# Altium project Board2.PrjPCB
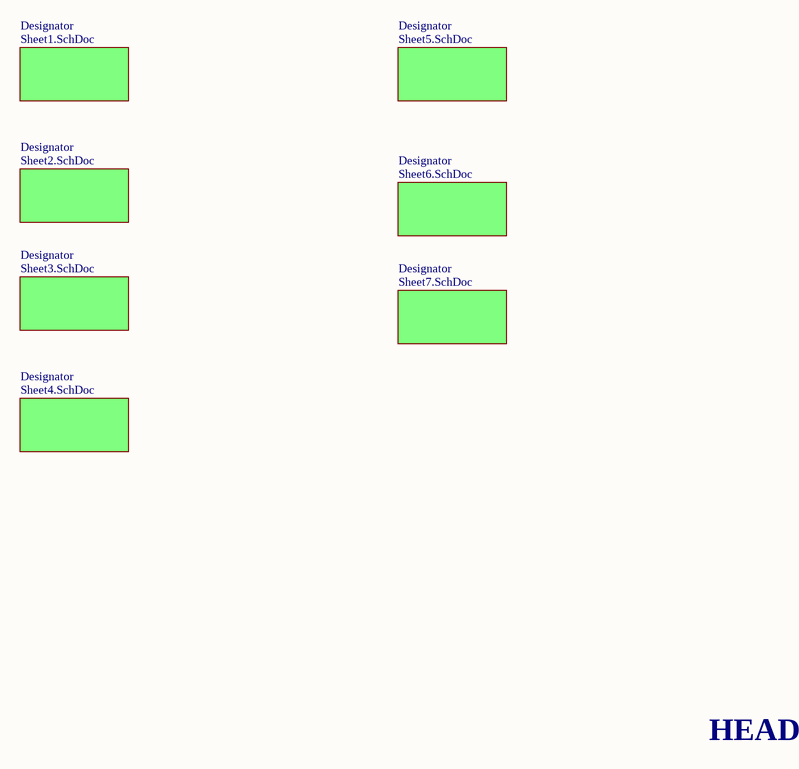
[diagram p0: HEAD.SchDoc]
8 sheets, 176 parts. Net scope: global (net labels, ports and power ports of the same name join across sheets).
Board file: Board2.PcbDoc
Sheets:
  HEAD.SchDoc
    Designator = Sheet1.SchDoc
    Designator = Sheet2.SchDoc
    Designator = Sheet3.SchDoc
    Designator = Sheet4.SchDoc
    Designator = Sheet5.SchDoc
    Designator = Sheet6.SchDoc
    Designator = Sheet7.SchDoc

## Sheet HEAD.SchDoc
size A4

### Sub-sheets
Designator = Sheet1.SchDoc: no entries
Designator = Sheet2.SchDoc: no entries
Designator = Sheet3.SchDoc: no entries
Designator = Sheet4.SchDoc: no entries
Designator = Sheet5.SchDoc: no entries
Designator = Sheet6.SchDoc: no entries
Designator = Sheet7.SchDoc: no entries

### Notes on the sheet
- HEAD

## Sheet Sheet1.SchDoc
size A4
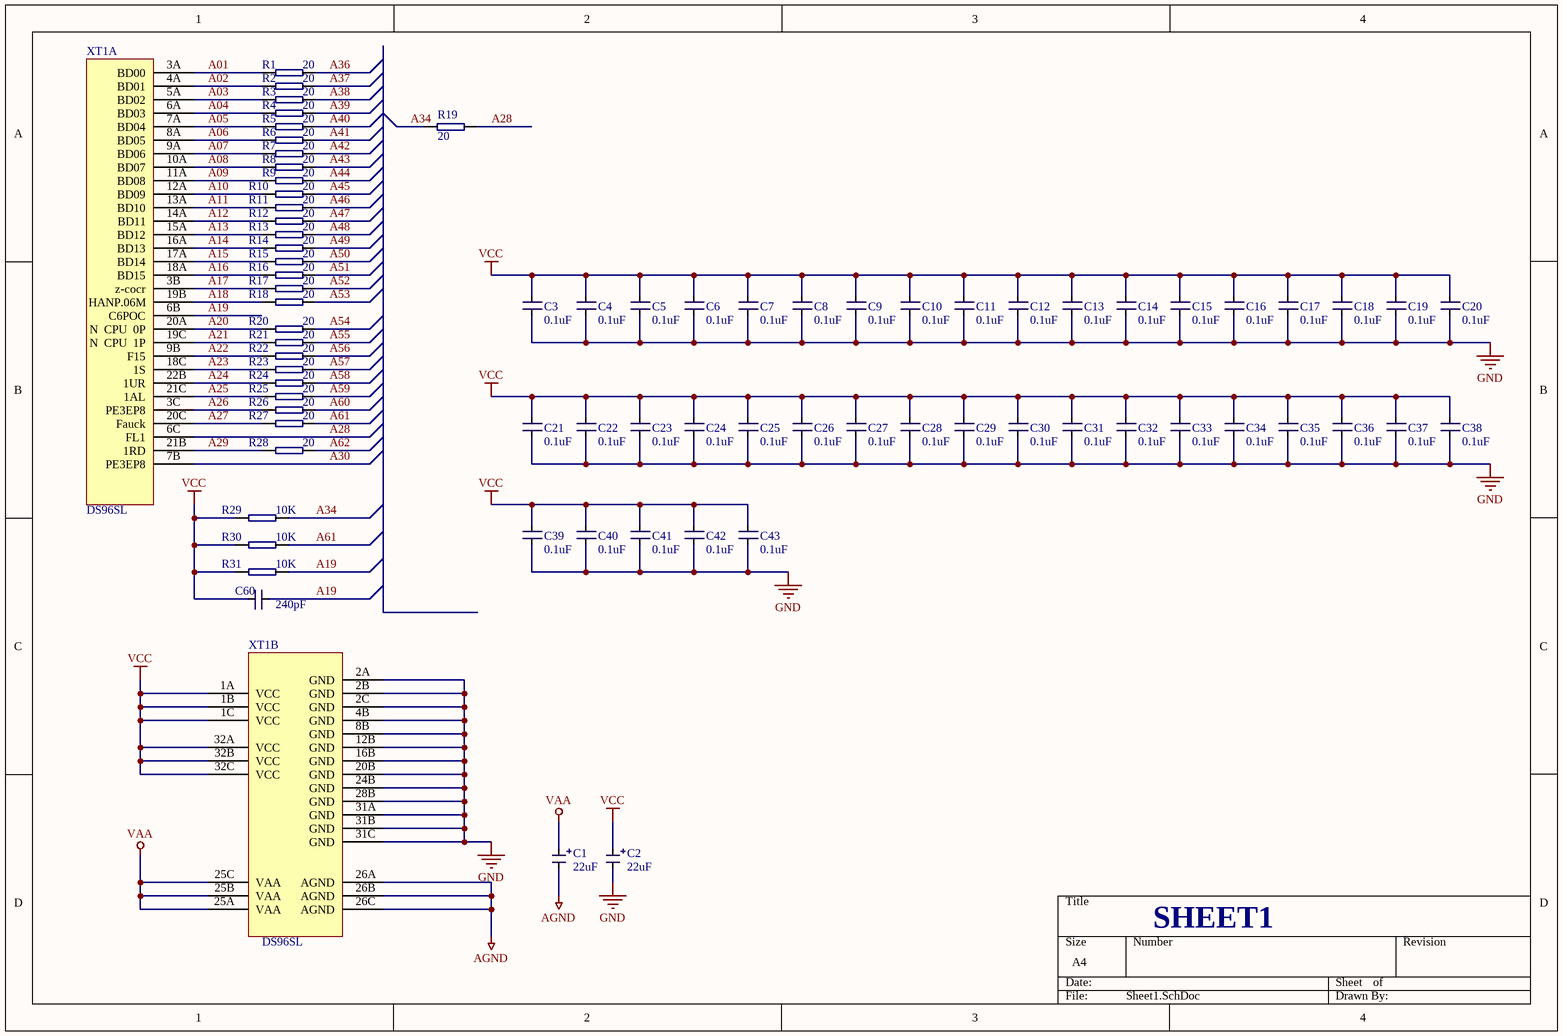
[diagram p1: Sheet1.SchDoc]

### Parts
C1  value 22uF  [B(1812)]  (hidden comment: Cap2)
C2  value 22uF  [B(1812)]  (hidden comment: Cap2)
C3  value 0.1uF  [0805]  (hidden comment: Cap)
C4  value 0.1uF  [0805]  (hidden comment: Cap)
C5  value 0.1uF  [0805]  (hidden comment: Cap)
C6  value 0.1uF  [0805]  (hidden comment: Cap)
C7  value 0.1uF  [0805]  (hidden comment: Cap)
C8  value 0.1uF  [0805]  (hidden comment: Cap)
C9  value 0.1uF  [0805]  (hidden comment: Cap)
C10  value 0.1uF  [0805]  (hidden comment: Cap)
C11  value 0.1uF  [0805]  (hidden comment: Cap)
C12  value 0.1uF  [0805]  (hidden comment: Cap)
C13  value 0.1uF  [0805]  (hidden comment: Cap)
C14  value 0.1uF  [0805]  (hidden comment: Cap)
C15  value 0.1uF  [0805]  (hidden comment: Cap)
C16  value 0.1uF  [0805]  (hidden comment: Cap)
C17  value 0.1uF  [0805]  (hidden comment: Cap)
C18  value 0.1uF  [0805]  (hidden comment: Cap)
C19  value 0.1uF  [0805]  (hidden comment: Cap)
C20  value 0.1uF  [0805]  (hidden comment: Cap)
C21  value 0.1uF  [0805]  (hidden comment: Cap)
C22  value 0.1uF  [0805]  (hidden comment: Cap)
C23  value 0.1uF  [0805]  (hidden comment: Cap)
C24  value 0.1uF  [0805]  (hidden comment: Cap)
C25  value 0.1uF  [0805]  (hidden comment: Cap)
C26  value 0.1uF  [0805]  (hidden comment: Cap)
C27  value 0.1uF  [0805]  (hidden comment: Cap)
C28  value 0.1uF  [0805]  (hidden comment: Cap)
C29  value 0.1uF  [0805]  (hidden comment: Cap)
C30  value 0.1uF  [0805]  (hidden comment: Cap)
C31  value 0.1uF  [0805]  (hidden comment: Cap)
C32  value 0.1uF  [0805]  (hidden comment: Cap)
C33  value 0.1uF  [0805]  (hidden comment: Cap)
C34  value 0.1uF  [0805]  (hidden comment: Cap)
C35  value 0.1uF  [0805]  (hidden comment: Cap)
C36  value 0.1uF  [0805]  (hidden comment: Cap)
C37  value 0.1uF  [0805]  (hidden comment: Cap)
C38  value 0.1uF  [0805]  (hidden comment: Cap)
C39  value 0.1uF  [0805]  (hidden comment: Cap)
C40  value 0.1uF  [0805]  (hidden comment: Cap)
C41  value 0.1uF  [0805]  (hidden comment: Cap)
C42  value 0.1uF  [0805]  (hidden comment: Cap)
C43  value 0.1uF  [0805]  (hidden comment: Cap)
C60  value 240pF  [0805]  (hidden comment: Cap)
R1  value 20  [0805]  (hidden comment: R)
R2  value 20  [0805]  (hidden comment: R)
R3  value 20  [0805]  (hidden comment: R)
R4  value 20  [0805]  (hidden comment: R)
R5  value 20  [0805]  (hidden comment: R)
R6  value 20  [0805]  (hidden comment: R)
R7  value 20  [0805]  (hidden comment: R)
R8  value 20  [0805]  (hidden comment: R)
R9  value 20  [0805]  (hidden comment: R)
R10  value 20  [0805]  (hidden comment: R)
R11  value 20  [0805]  (hidden comment: R)
R12  value 20  [0805]  (hidden comment: R)
R13  value 20  [0805]  (hidden comment: R)
R14  value 20  [0805]  (hidden comment: R)
R15  value 20  [0805]  (hidden comment: R)
R16  value 20  [0805]  (hidden comment: R)
R17  value 20  [0805]  (hidden comment: R)
R18  value 20  [0805]  (hidden comment: R)
R19  value 20  [0805]  (hidden comment: R)
R20  value 20  [0805]  (hidden comment: R)
R21  value 20  [0805]  (hidden comment: R)
R22  value 20  [0805]  (hidden comment: R)
R23  value 20  [0805]  (hidden comment: R)
R24  value 20  [0805]  (hidden comment: R)
R25  value 20  [0805]  (hidden comment: R)
R26  value 20  [0805]  (hidden comment: R)
R27  value 20  [0805]  (hidden comment: R)
R28  value 20  [0805]  (hidden comment: R)
R29  value 10K  [0805]  (hidden comment: R)
R30  value 10K  [0805]  (hidden comment: R)
R31  value 10K  [0805]  (hidden comment: R)
XT1  DS96SL  [DS96]  (parts A,B of 3)

### Nets
AGND: C1.2 XT1.26A(AGND) XT1.26B(AGND) XT1.26C(AGND)  [project net B110]
GND: C2.2 C3.1 C4.1 C5.1 C6.1 C7.1 C8.1 C9.1 C10.1 C11.1 C12.1 C13.1 C14.1 C15.1 C16.1 C17.1 C18.1 C19.1 C20.1 C21.1 C22.1 C23.1 C24.1 C25.1 C26.1 C27.1 C28.1 C29.1 C30.1 C31.1 C32.1 C33.1 C34.1 C35.1 C36.1 C37.1 C38.1 C39.1 C40.1 C41.1 C42.1 C43.1 XT1.2A(GND) XT1.2B(GND) XT1.2C(GND) XT1.4B(GND) XT1.8B(GND) XT1.12B(GND) XT1.16B(GND) XT1.20B(GND) XT1.24B(GND) XT1.28B(GND) XT1.31A(GND) XT1.31B(GND) XT1.31C(GND)
VAA: C1.1 XT1.25A(VAA) XT1.25B(VAA) XT1.25C(VAA)
VCC: C2.1 C3.2 C4.2 C5.2 C6.2 C7.2 C8.2 C9.2 C10.2 C11.2 C12.2 C13.2 C14.2 C15.2 C16.2 C17.2 C18.2 C19.2 C20.2 C21.2 C22.2 C23.2 C24.2 C25.2 C26.2 C27.2 C28.2 C29.2 C30.2 C31.2 C32.2 C33.2 C34.2 C35.2 C36.2 C37.2 C38.2 C39.2 C40.2 C41.2 C42.2 C43.2 C60.1 R29.1 R30.1 R31.1 XT1.1A(VCC) XT1.1B(VCC) XT1.1C(VCC) XT1.32A(VCC) XT1.32B(VCC) XT1.32C(VCC)
A01: R1.1 XT1.3A(BD00)
A02: R2.1 XT1.4A(BD01)
A03: R3.1 XT1.5A(BD02)
A04: R4.1 XT1.6A(BD03)
A05: R5.1 XT1.7A(BD04)
A06: R6.1 XT1.8A(BD05)
A07: R7.1 XT1.9A(BD06)
A08: R8.1 XT1.10A(BD07)
A09: R9.1 XT1.11A(BD08)
A10: R10.1 XT1.12A(BD09)
A11: R11.1 XT1.13A(BD10)
A12: R12.1 XT1.14A(BD11)
A13: R13.1 XT1.15A(BD12)
A14: R14.1 XT1.16A(BD13)
A15: R15.1 XT1.17A(BD14)
A16: R16.1 XT1.18A(BD15)
A17: R17.1 XT1.3B(z-cocr)
A18: R18.1 XT1.19B(HANP.06M)
A19: C60.2 R31.2 XT1.6B(C6POC)
A20: R20.1 XT1.20A(N__CPU__0P)
A21: R21.1 XT1.19C(N__CPU__1P)
A22: R22.1 XT1.9B(F15)
A23: R23.1 XT1.18C(1S)
A24: R24.1 XT1.22B(1UR)
A25: R25.1 XT1.21C(1AL)
A26: R26.1 XT1.3C(PE3EP8)
A27: R27.1 XT1.20C(Fauck)
A28: R19.1 XT1.6C(FL1)
A29: R28.1 XT1.21B(1RD)
A30: XT1.7B(PE3EP8)
A34: R19.2 R29.2
A36: R1.2
A37: R2.2
A38: R3.2
A39: R4.2
A40: R5.2
A41: R6.2
A42: R7.2
A43: R8.2
A44: R9.2
A45: R10.2
A46: R11.2
A47: R12.2
A48: R13.2
A49: R14.2
A50: R15.2
A51: R16.2
A52: R17.2
A53: R18.2
A54: R20.2
A55: R21.2
A56: R22.2
A57: R23.2
A58: R24.2
A59: R25.2
A60: R26.2
A61: R27.2 R30.2
A62: R28.2

### Notes on the sheet
- SHEET1

## Sheet Sheet2.SchDoc
size A4
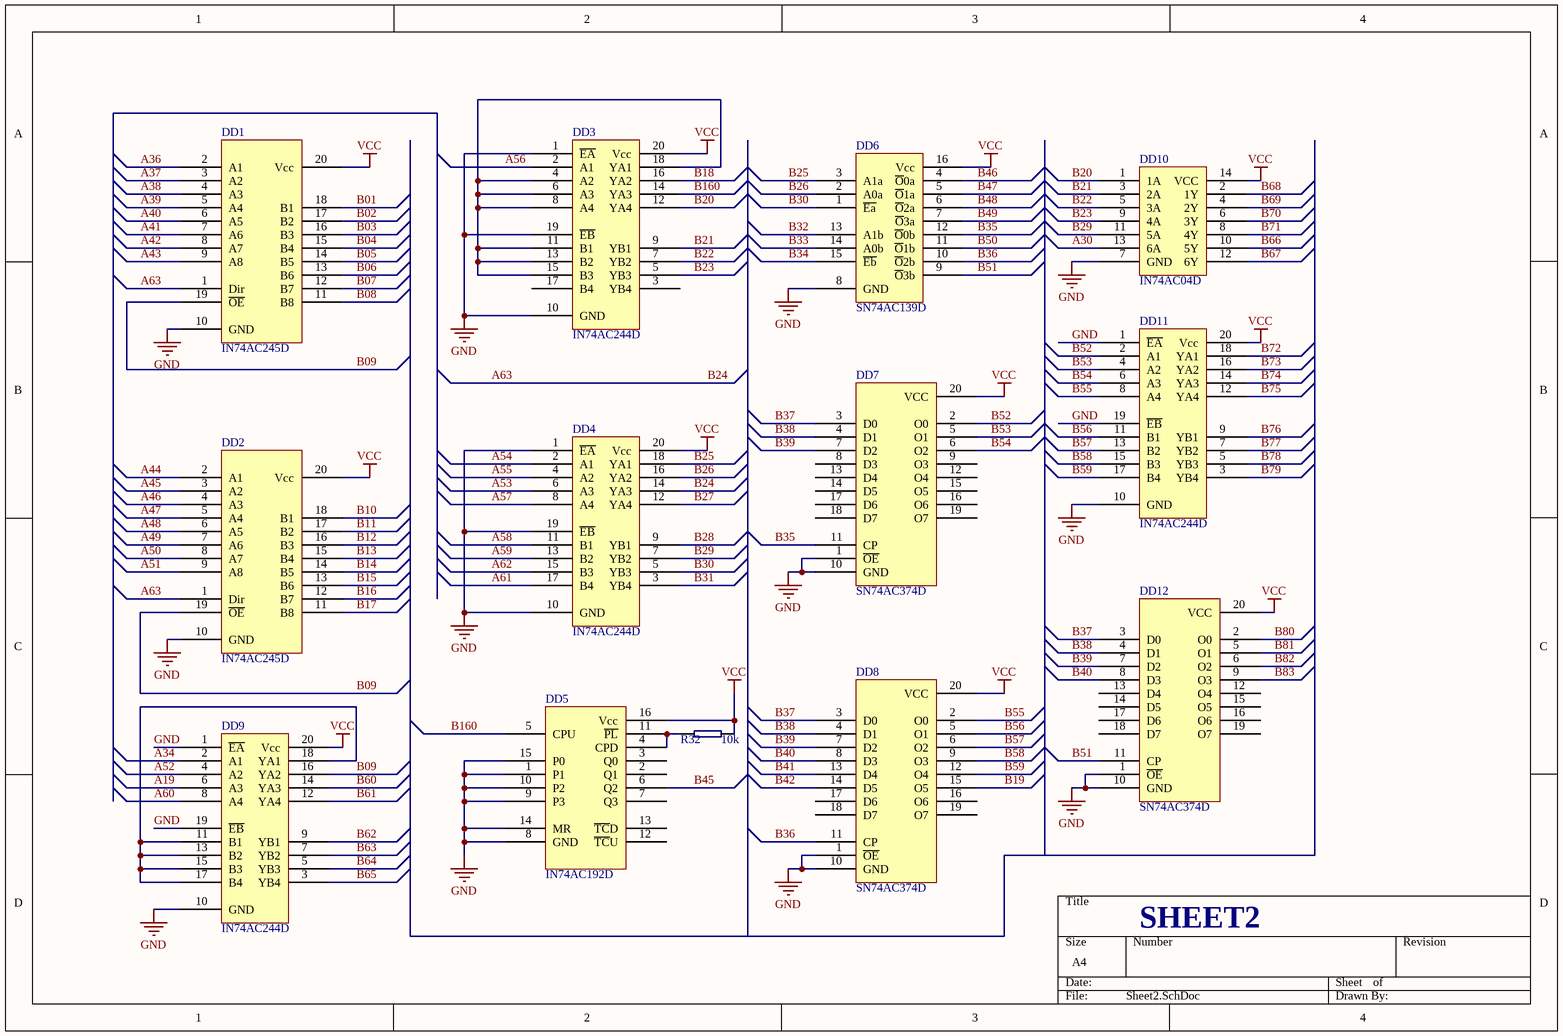
[diagram p2: Sheet2.SchDoc]

### Parts
DD1  IN74AC245D  [20 SSOP-4.4]
DD2  IN74AC245D  [20 SSOP-4.4]
DD3  IN74AC244D  [20 SOIC-7.5]
DD4  IN74AC244D  [20 SOIC-7.5]
DD5  IN74AC192D  [16 SOIC-3.9]
DD6  SN74AC139D  [16 SOIC-3.9]
DD7  SN74AC374D  [20 SOIC-7.5]
DD8  SN74AC374D  [20 SOIC-7.5]
DD9  IN74AC244D  [20 SOIC-7.5]
DD10  IN74AC04D  [14 SOIC-3.9]
DD11  IN74AC244D  [20 SOIC-7.5]
DD12  SN74AC374D  [20 SOIC-7.5]
R32  value 10k  [0805]  (hidden comment: R)

### Nets
GND: DD1.10(GND) DD2.10(GND) DD3.1(~{EA}) DD3.10(GND) DD3.19(~{EB}) DD4.1(~{EA}) DD4.10(GND) DD4.19(~{EB}) DD5.1(P1) DD5.8(GND) DD5.9(P3) DD5.10(P2) DD5.14(MR) DD5.15(P0) DD6.8(GND) DD7.1(~{OE}) DD7.10(GND) DD8.1(~{OE}) DD8.10(GND) DD9.1(~{EA}) DD9.10(GND) DD9.19(~{EB}) DD10.7(GND) DD11.1(~{EA}) DD11.10(GND) DD11.19(~{EB}) DD12.1(~{OE}) DD12.10(GND)
VCC: DD1.20(Vcc) DD2.20(Vcc) DD3.20(Vcc) DD4.20(Vcc) DD5.16(Vcc) DD6.16(Vcc) DD7.20(VCC) DD8.20(VCC) DD9.20(Vcc) DD10.14(VCC) DD11.20(Vcc) DD12.20(VCC) R32.2
A19: DD9.6(A3)
A30: DD10.13(6A)
A34: DD9.2(A1)
A36: DD1.2(A1)
A37: DD1.3(A2)
A38: DD1.4(A3)
A39: DD1.5(A4)
A40: DD1.6(A5)
A41: DD1.7(A6)
A42: DD1.8(A7)
A43: DD1.9(A8)
A44: DD2.2(A1)
A45: DD2.3(A2)
A46: DD2.4(A3)
A47: DD2.5(A4)
A48: DD2.6(A5)
A49: DD2.7(A6)
A50: DD2.8(A7)
A51: DD2.9(A8)
A52: DD9.4(A2)
A53: DD4.6(A3)
A54: DD4.2(A1)
A55: DD4.4(A2)
A56: DD3.2(A1)
A57: DD4.8(A4)
A58: DD4.11(B1)
A59: DD4.13(B2)
A60: DD9.8(A4)
A61: DD4.17(B4)
A62: DD4.15(B3)
A63: DD1.1(Dir) DD2.1(Dir) DD4.14(YA3)  [also labelled B24]
B01: DD1.18(B1)
B02: DD1.17(B2)
B03: DD1.16(B3)
B04: DD1.15(B4)
B05: DD1.14(B5)
B06: DD1.13(B6)
B07: DD1.12(B7)
B08: DD1.11(B8)
B09: DD1.19(~{OE}) DD2.19(~{OE}) DD9.16(YA2)
B10: DD2.18(B1)
B11: DD2.17(B2)
B12: DD2.16(B3)
B13: DD2.15(B4)
B14: DD2.14(B5)
B15: DD2.13(B6)
B16: DD2.12(B7)
B17: DD2.11(B8)
B18: DD3.16(YA2)
B19: DD8.15(O5)
B20: DD3.12(YA4) DD10.1(1A)
B21: DD3.9(YB1) DD10.3(2A)
B22: DD3.7(YB2) DD10.5(3A)
B23: DD3.5(YB3) DD10.9(4A)
B25: DD4.18(YA1) DD6.3(A1a)
B26: DD4.16(YA2) DD6.2(A0a)
B27: DD4.12(YA4)
B28: DD4.9(YB1)
B29: DD4.7(YB2) DD10.11(5A)
B30: DD4.5(YB3) DD6.1(~{Ea})
B31: DD4.3(YB4)
B32: DD6.13(A1b)
B33: DD6.14(A0b)
B34: DD6.15(~{Eb})
B35: DD6.12(~{O}0b) DD7.11(CP)
B36: DD6.10(~{O}2b) DD8.11(CP)
B37: DD7.3(D0) DD8.3(D0) DD12.3(D0)
B38: DD7.4(D1) DD8.4(D1) DD12.4(D1)
B39: DD7.7(D2) DD8.7(D2) DD12.7(D2)
B40: DD8.8(D3) DD12.8(D3)
B41: DD8.13(D4)
B42: DD8.14(D5)
B45: DD5.6(Q2)
B46: DD6.4(~{O}0a)
B47: DD6.5(~{O}1a)
B48: DD6.6(~{O}2a)
B49: DD6.7(~{O}3a)
B50: DD6.11(~{O}1b)
B51: DD6.9(~{O}3b) DD12.11(CP)
B52: DD7.2(O0) DD11.2(A1)
B53: DD7.5(O1) DD11.4(A2)
B54: DD7.6(O2) DD11.6(A3)
B55: DD8.2(O0) DD11.8(A4)
B56: DD8.5(O1) DD11.11(B1)
B57: DD8.6(O2) DD11.13(B2)
B58: DD8.9(O3) DD11.15(B3)
B59: DD8.12(O4) DD11.17(B4)
B60: DD9.14(YA3)
B61: DD9.12(YA4)
B62: DD9.9(YB1)
B63: DD9.7(YB2)
B64: DD9.5(YB3)
B65: DD9.3(YB4)
B66: DD10.10(5Y)
B67: DD10.12(6Y)
B68: DD10.2(1Y)
B69: DD10.4(2Y)
B70: DD10.6(3Y)
B71: DD10.8(4Y)
B72: DD11.18(YA1)
B73: DD11.16(YA2)
B74: DD11.14(YA3)
B75: DD11.12(YA4)
B76: DD11.9(YB1)
B77: DD11.7(YB2)
B78: DD11.5(YB3)
B79: DD11.3(YB4)
B80: DD12.2(O0)
B81: DD12.5(O1)
B82: DD12.6(O2)
B83: DD12.9(O3)
B160: DD3.14(YA3) DD5.5(CPU)
NetDD3_4: DD3.4(A2) DD3.6(A3) DD3.8(A4) DD3.11(B1) DD3.13(B2) DD3.15(B3) DD3.18(YA1)
NetDD5_4: DD5.4(CPD) DD5.11(~{PL}) R32.1
NetDD9_11: DD9.11(B1) DD9.13(B2) DD9.15(B3) DD9.17(B4) DD9.18(YA1)

Not connected (* = marked no-connect by the designer): DD3 3(YB4) 17(B4); DD5 2(Q1) 3(Q0) 7(Q3) 12(~{TC}U) 13(~{TC}D); DD7 8(D3) 9(O3) 12(O4) 13(D4) 14(D5) 15(O5) 16(O6) 17(D6) 18(D7) 19(O7); DD8 16(O6) 17(D6) 18(D7) 19(O7); DD12 12(O4) 13(D4) 14(D5) 15(O5) 16(O6) 17(D6) 18(D7) 19(O7)

### Notes on the sheet
- SHEET2

## Sheet Sheet3.SchDoc
size A4
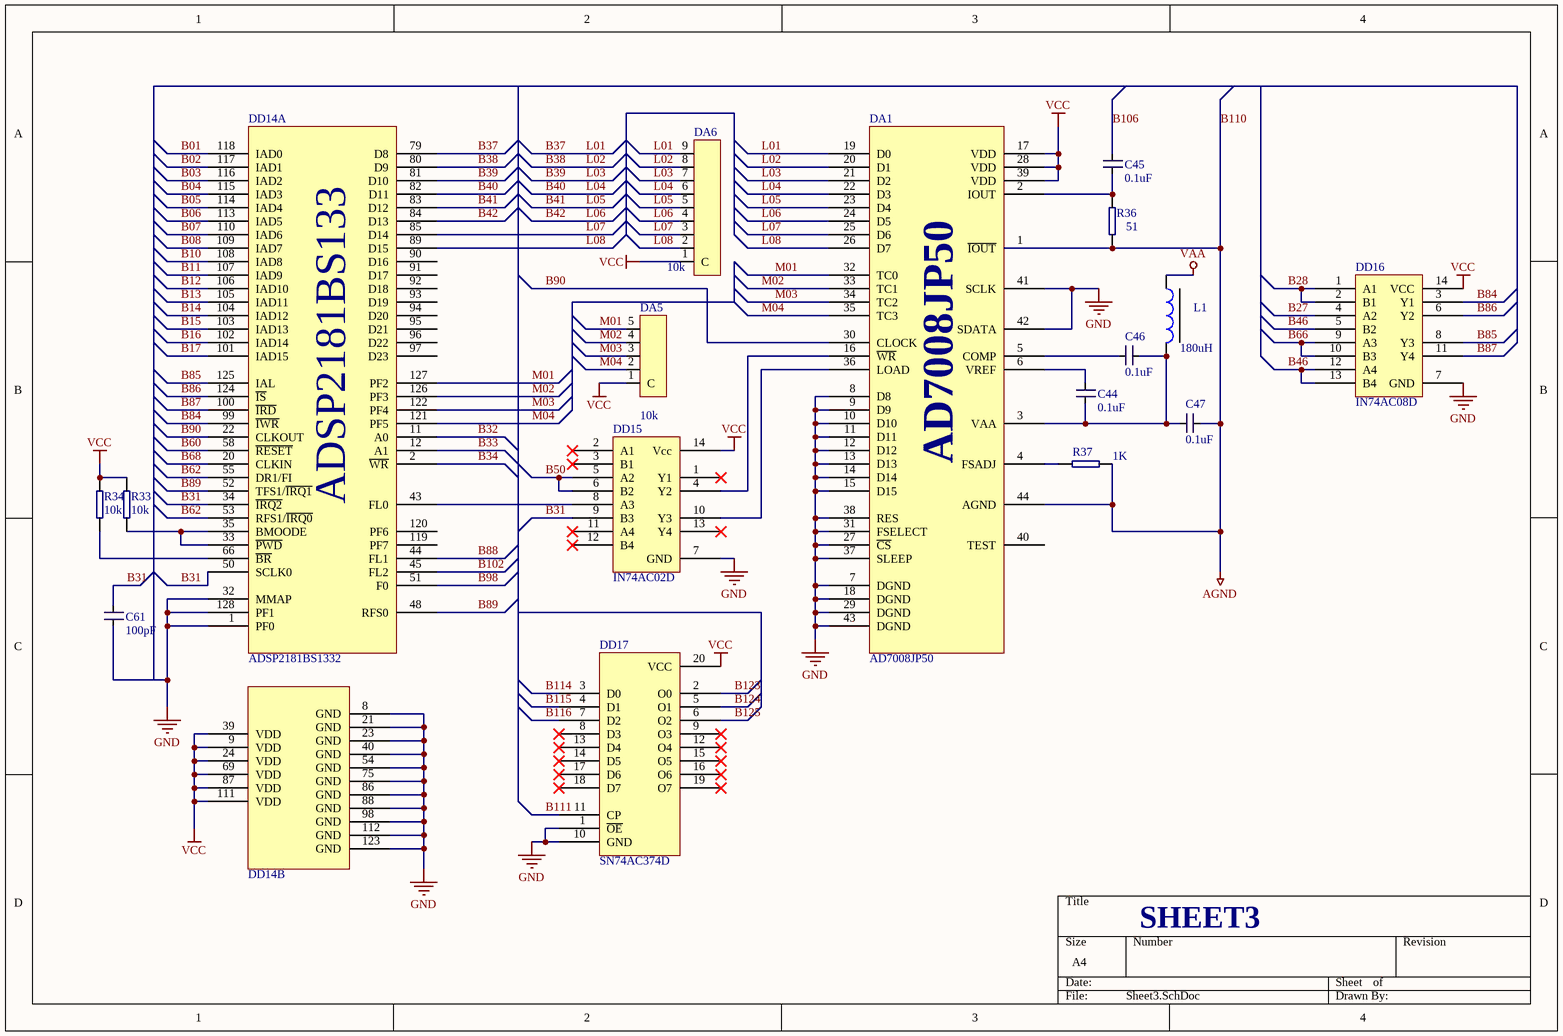
[diagram p3: Sheet3.SchDoc]

### Parts
C44  value 0.1uF  [0805]  (hidden comment: Cap)
C45  value 0.1uF  [0805]  (hidden comment: Cap)
C46  value 0.1uF  [0805]  (hidden comment: Cap)
C47  value 0.1uF  [0805]  (hidden comment: Cap)
C61  value 100pF  [0805]  (hidden comment: Cap)
DA1  AD7008JP50  [44 PLCC]
DA5  value 10k  [5 SIP]  (hidden comment: 5A103J)
DA6  value 10k  [9 SIP]  (hidden comment: 9A103J)
DD14  ADSP2181BS1332  [128 PQFP]  (parts A,B of 2)
DD15  IN74AC02D  [14 SOIC-3.9]
DD16  IN74AC08D  [14 TSSOP-4.4]
DD17  SN74AC374D  [20 SOIC-7.5]
L1  value 180uH  [E(1820)]  (hidden comment: L)
R33  value 10k  [0805]  (hidden comment: R)
R34  value 10k  [0805]  (hidden comment: R)
R36  value 51  [0805]  (hidden comment: R)
R37  value 1K  [0805]  (hidden comment: R)

### Nets
B110: C47.1 DA1.1(~{IOUT}) DA1.44(AGND) R36.1 R37.2  [also labelled AGND]
GND: C61.1 DA1.7(DGND) DA1.8(D8) DA1.9(D9) DA1.10(D10) DA1.11(D11) DA1.12(D12) DA1.13(D13) DA1.14(D14) DA1.15(D15) DA1.18(DGND) DA1.27(~{CS}) DA1.29(DGND) DA1.31(FSELECT) DA1.37(SLEEP) DA1.38(RES) DA1.41(SCLK) DA1.42(SDATA) DA1.43(DGND) DD14.1(PF0) DD14.8(GND) DD14.21(GND) DD14.23(GND) DD14.32(MMAP) DD14.40(GND) DD14.54(GND) DD14.75(GND) DD14.86(GND) DD14.88(GND) DD14.98(GND) DD14.112(GND) DD14.123(GND) DD14.128(PF1) DD15.7(GND) DD16.7(GND) DD17.1(~{OE}) DD17.10(GND)
VAA: L1.1
VCC: DA1.17(VDD) DA1.28(VDD) DA1.39(VDD) DA5.1(C) DA6.1(C) DD14.9(VDD) DD14.24(VDD) DD14.39(VDD) DD14.69(VDD) DD14.87(VDD) DD14.111(VDD) DD15.14(Vcc) DD16.14(VCC) DD17.20(VCC) R33.2 R34.2
B01: DD14.118(IAD0)
B02: DD14.117(IAD1)
B03: DD14.116(IAD2)
B04: DD14.115(IAD3)
B05: DD14.114(IAD4)
B06: DD14.113(IAD5)
B07: DD14.110(IAD6)
B08: DD14.109(IAD7)
B10: DD14.108(IAD8)
B11: DD14.107(IAD9)
B12: DD14.106(IAD10)
B13: DD14.105(IAD11)
B14: DD14.104(IAD12)
B15: DD14.103(IAD13)
B16: DD14.102(IAD14)
B17: DD14.101(IAD15)
B27: DD16.4(A2)
B28: DD16.1(A1) DD16.2(B1)
B31: C61.2 DD14.34(~{IRQ2}) DD14.50(SCLK0) DD15.9(B3)
B32: DD14.11(A0)
B33: DD14.12(A1)
B34: DD14.2(~{WR})
B37: DA1.19(D0) DA6.9 DD14.79(D8)  [also labelled L01]
B38: DA1.20(D1) DA6.8 DD14.80(D9)  [also labelled L02]
B39: DA1.21(D2) DA6.7 DD14.81(D10)  [also labelled L03]
B40: DA1.22(D3) DA6.6 DD14.82(D11)  [also labelled L04]
B41: DA1.23(D4) DA6.5 DD14.83(D12)  [also labelled L05]
B42: DA1.24(D5) DA6.4 DD14.84(D13)  [also labelled L06]
B46: DD16.5(B2) DD16.12(A4) DD16.13(B4)
B50: DD15.5(A2) DD15.6(B2)
B60: DD14.58(~{RESET})
B62: DD14.53(RFS1/~{IRQ0}) DD14.55(DR1/FI)
B66: DD16.9(A3) DD16.10(B3)
B68: DD14.20(CLKIN)
B84: DD14.99(~{IWR}) DD16.3(Y1)
B85: DD14.125(IAL) DD16.8(Y3)
B86: DD14.124(~{IS}) DD16.6(Y2)
B87: DD14.100(~{IRD}) DD16.11(Y4)
B88: DD14.44(FL1)
B89: DD14.48(RFS0) DD14.52(TFS1/~{IRQ1})
B90: DA1.30(CLOCK) DD14.22(CLKOUT)
B98: DD14.51(F0)
B102: DD14.45(FL2)
B106: C45.2
B111: DD17.11(CP)
B114: DD17.3(D0)
B115: DD17.4(D1)
B116: DD17.7(D2)
B123: DD17.2(O0)
B124: DD17.5(O1)
B125: DD17.6(O2)
L07: DA1.25(D6) DA6.3 DD14.85(D14)
L08: DA1.26(D7) DA6.2 DD14.89(D15)
M01: DA1.32(TC0) DA5.5 DD14.127(PF2)
M02: DA1.33(TC1) DA5.4 DD14.126(PF3)
M03: DA1.34(TC2) DA5.3 DD14.122(PF4)
M04: DA1.35(TC3) DA5.2 DD14.121(PF5)
NetC44_1: C44.1 C46.1 C47.2 DA1.3(VAA) L1.2
NetC44_2: C44.2 DA1.6(VREF)
NetC45_1: C45.1 DA1.2(IOUT) R36.2
NetC46_2: C46.2 DA1.5(COMP)
NetDA1_4: DA1.4(FSADJ) R37.1
NetDA1_16: DA1.16(~{WR}) DD15.4(Y2)
NetDA1_36: DA1.36(LOAD) DD15.10(Y3)
NetDD14_33: DD14.33(~{PWD}) DD14.35(BMOODE) R33.1
NetDD14_43: DD14.43(FL0) DD15.8(A3)
NetDD14_66: DD14.66(~{BR}) R34.1

Not connected (* = marked no-connect by the designer): DA1 40(TEST); DD14 90(D16) 91(D17) 92(D18) 93(D19) 94(D20) 95(D21) 96(D22) 97(D23) 119(PF7) 120(PF6); DD15 1(Y1)* 2(A1)* 3(B1)* 11(A4)* 12(B4)* 13(Y4)*; DD17 8(D3)* 9(O3)* 12(O4)* 13(D4)* 14(D5)* 15(O5)* 16(O6)* 17(D6)* 18(D7)* 19(O7)*

### Notes on the sheet
- SHEET3
- (in symbol ADSP2181BS1332, part A) ADSP2181BS133

## Sheet Sheet4.SchDoc
size A4
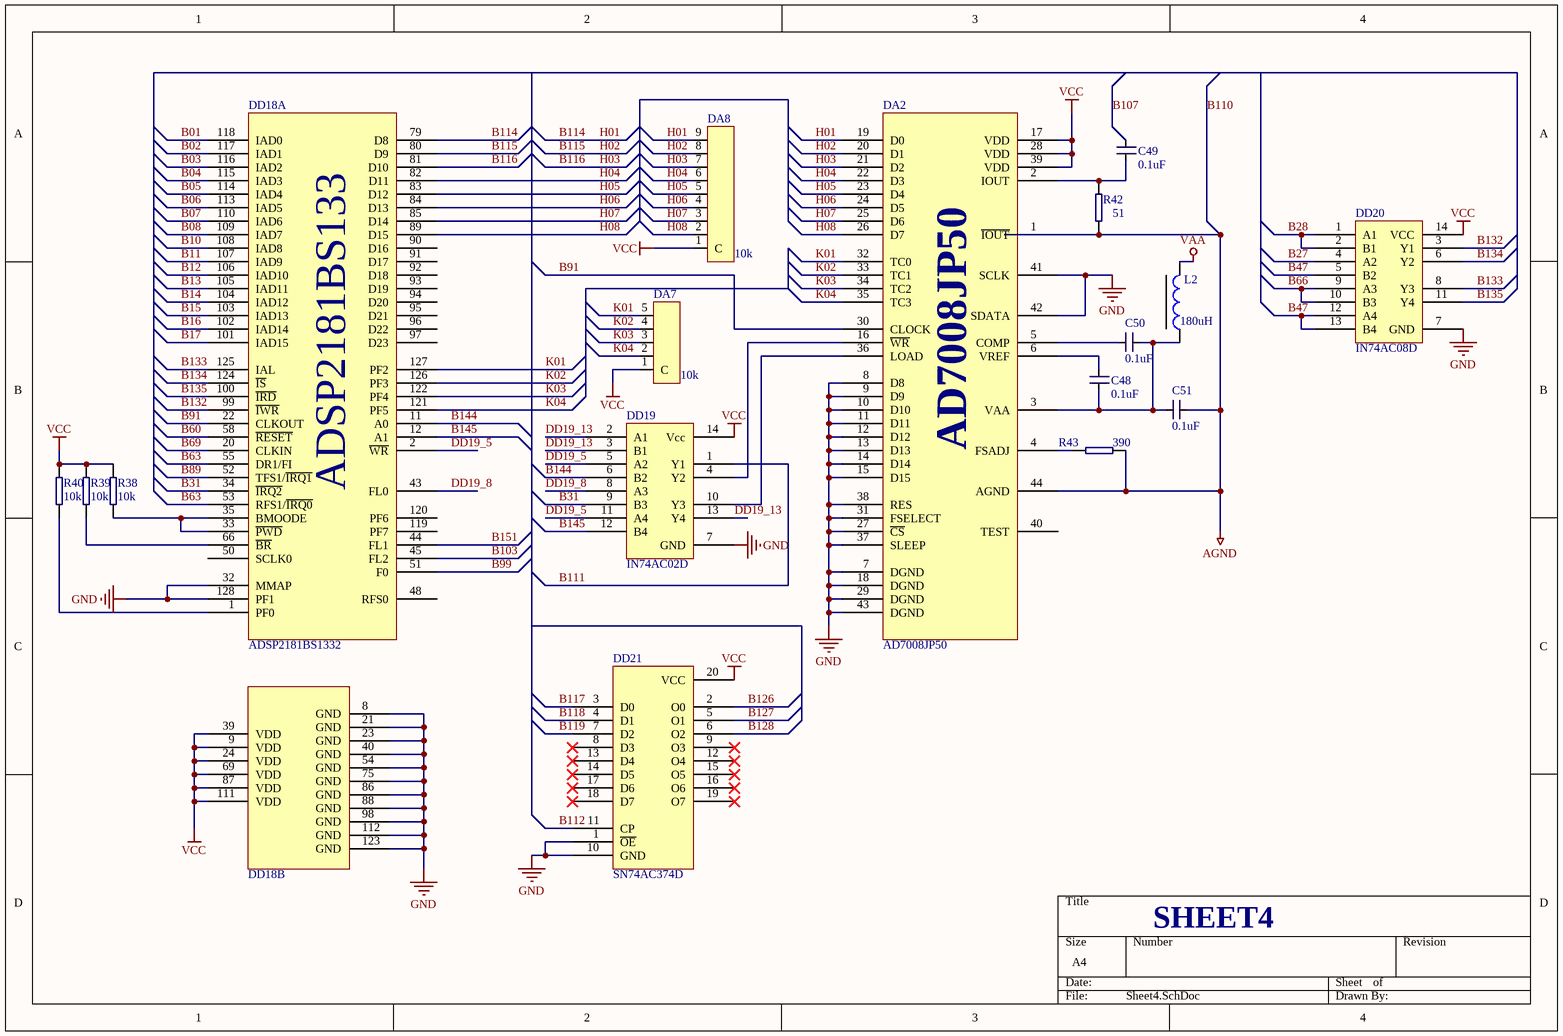
[diagram p4: Sheet4.SchDoc]

### Parts
C48  value 0.1uF  [0805]  (hidden comment: Cap)
C49  value 0.1uF  [0805]  (hidden comment: Cap)
C50  value 0.1uF  [0805]  (hidden comment: Cap)
C51  value 0.1uF  [0805]  (hidden comment: Cap)
DA2  AD7008JP50  [44 PLCC]
DA7  value 10k  [5 SIP]  (hidden comment: 5A103J)
DA8  value 10k  [9 SIP]  (hidden comment: 9A103J)
DD18  ADSP2181BS1332  [128 PQFP]  (parts A,B of 2)
DD19  IN74AC02D  [14 SOIC-3.9]
DD20  IN74AC08D  [14 TSSOP-4.4]
DD21  SN74AC374D  [20 SOIC-7.5]
L2  value 180uH  [E(1820)]  (hidden comment: L)
R38  value 10k  [0805]  (hidden comment: R)
R39  value 10k  [0805]  (hidden comment: R)
R40  value 10k  [0805]  (hidden comment: R)
R42  value 51  [0805]  (hidden comment: R)
R43  value 390  [0805]  (hidden comment: R)

### Nets
B110: C51.1 DA2.1(~{IOUT}) DA2.44(AGND) R42.1 R43.2  [also labelled AGND]
GND: DA2.7(DGND) DA2.8(D8) DA2.9(D9) DA2.10(D10) DA2.11(D11) DA2.12(D12) DA2.13(D13) DA2.14(D14) DA2.15(D15) DA2.18(DGND) DA2.27(~{CS}) DA2.29(DGND) DA2.31(FSELECT) DA2.37(SLEEP) DA2.38(RES) DA2.41(SCLK) DA2.42(SDATA) DA2.43(DGND) DD18.8(GND) DD18.21(GND) DD18.23(GND) DD18.32(MMAP) DD18.40(GND) DD18.54(GND) DD18.75(GND) DD18.86(GND) DD18.88(GND) DD18.98(GND) DD18.112(GND) DD18.123(GND) DD18.128(PF1) DD19.7(GND) DD20.7(GND) DD21.1(~{OE}) DD21.10(GND)
VAA: L2.2
VCC: DA2.17(VDD) DA2.28(VDD) DA2.39(VDD) DA7.1(C) DA8.1(C) DD18.9(VDD) DD18.24(VDD) DD18.39(VDD) DD18.69(VDD) DD18.87(VDD) DD18.111(VDD) DD19.14(Vcc) DD20.14(VCC) DD21.20(VCC) R38.2 R39.2 R40.2
B01: DD18.118(IAD0)
B02: DD18.117(IAD1)
B03: DD18.116(IAD2)
B04: DD18.115(IAD3)
B05: DD18.114(IAD4)
B06: DD18.113(IAD5)
B07: DD18.110(IAD6)
B08: DD18.109(IAD7)
B10: DD18.108(IAD8)
B11: DD18.107(IAD9)
B12: DD18.106(IAD10)
B13: DD18.105(IAD11)
B14: DD18.104(IAD12)
B15: DD18.103(IAD13)
B16: DD18.102(IAD14)
B17: DD18.101(IAD15)
B27: DD20.4(A2)
B28: DD20.1(A1) DD20.2(B1)
B31: DD18.34(~{IRQ2}) DD19.9(B3)
B47: DD20.5(B2) DD20.12(A4) DD20.13(B4)
B60: DD18.58(~{RESET})
B63: DD18.53(RFS1/~{IRQ0}) DD18.55(DR1/FI)
B66: DD20.9(A3) DD20.10(B3)
B69: DD18.20(CLKIN)
B89: DD18.52(TFS1/~{IRQ1})
B91: DA2.30(CLOCK) DD18.22(CLKOUT)
B99: DD18.51(F0)
B103: DD18.45(FL2)
B107: C49.2
B111: DD19.1(Y1)
B112: DD21.11(CP)
B114: DA2.19(D0) DA8.9 DD18.79(D8)  [also labelled H01]
B115: DA2.20(D1) DA8.8 DD18.80(D9)  [also labelled H02]
B116: DA2.21(D2) DA8.7 DD18.81(D10)  [also labelled H03]
B117: DD21.3(D0)
B118: DD21.4(D1)
B119: DD21.7(D2)
B126: DD21.2(O0)
B127: DD21.5(O1)
B128: DD21.6(O2)
B132: DD18.99(~{IWR}) DD20.3(Y1)
B133: DD18.125(IAL) DD20.8(Y3)
B134: DD18.124(~{IS}) DD20.6(Y2)
B135: DD18.100(~{IRD}) DD20.11(Y4)
B144: DD18.11(A0) DD19.6(B2)
B145: DD18.12(A1) DD19.12(B4)
B151: DD18.44(FL1)
DD19_5: DD18.2(~{WR}) DD19.5(A2) DD19.11(A4)
DD19_8: DD18.43(FL0) DD19.8(A3)
DD19_13: DD19.2(A1) DD19.3(B1) DD19.13(Y4)
H04: DA2.22(D3) DA8.6 DD18.82(D11)
H05: DA2.23(D4) DA8.5 DD18.83(D12)
H06: DA2.24(D5) DA8.4 DD18.84(D13)
H07: DA2.25(D6) DA8.3 DD18.85(D14)
H08: DA2.26(D7) DA8.2 DD18.89(D15)
K01: DA2.32(TC0) DA7.5 DD18.127(PF2)
K02: DA2.33(TC1) DA7.4 DD18.126(PF3)
K03: DA2.34(TC2) DA7.3 DD18.122(PF4)
K04: DA2.35(TC3) DA7.2 DD18.121(PF5)
NetC48_1: C48.1 C50.1 C51.2 DA2.3(VAA) L2.1
NetC48_2: C48.2 DA2.6(VREF)
NetC49_1: C49.1 DA2.2(IOUT) R42.2
NetC50_2: C50.2 DA2.5(COMP)
NetDA2_4: DA2.4(FSADJ) R43.1
NetDA2_16: DA2.16(~{WR}) DD19.4(Y2)
NetDA2_36: DA2.36(LOAD) DD19.10(Y3)
NetDD18_1: DD18.1(PF0) R40.1
NetDD18_33: DD18.33(~{PWD}) DD18.35(BMOODE) R38.1
NetDD18_66: DD18.66(~{BR}) R39.1

Not connected (* = marked no-connect by the designer): DA2 40(TEST); DD18 48(RFS0) 50(SCLK0) 90(D16) 91(D17) 92(D18) 93(D19) 94(D20) 95(D21) 96(D22) 97(D23) 119(PF7) 120(PF6); DD21 8(D3)* 9(O3)* 12(O4)* 13(D4)* 14(D5)* 15(O5)* 16(O6)* 17(D6)* 18(D7)* 19(O7)*

### Notes on the sheet
- SHEET4
- (in symbol ADSP2181BS1332, part A) ADSP2181BS133

## Sheet Sheet5.SchDoc
size A4
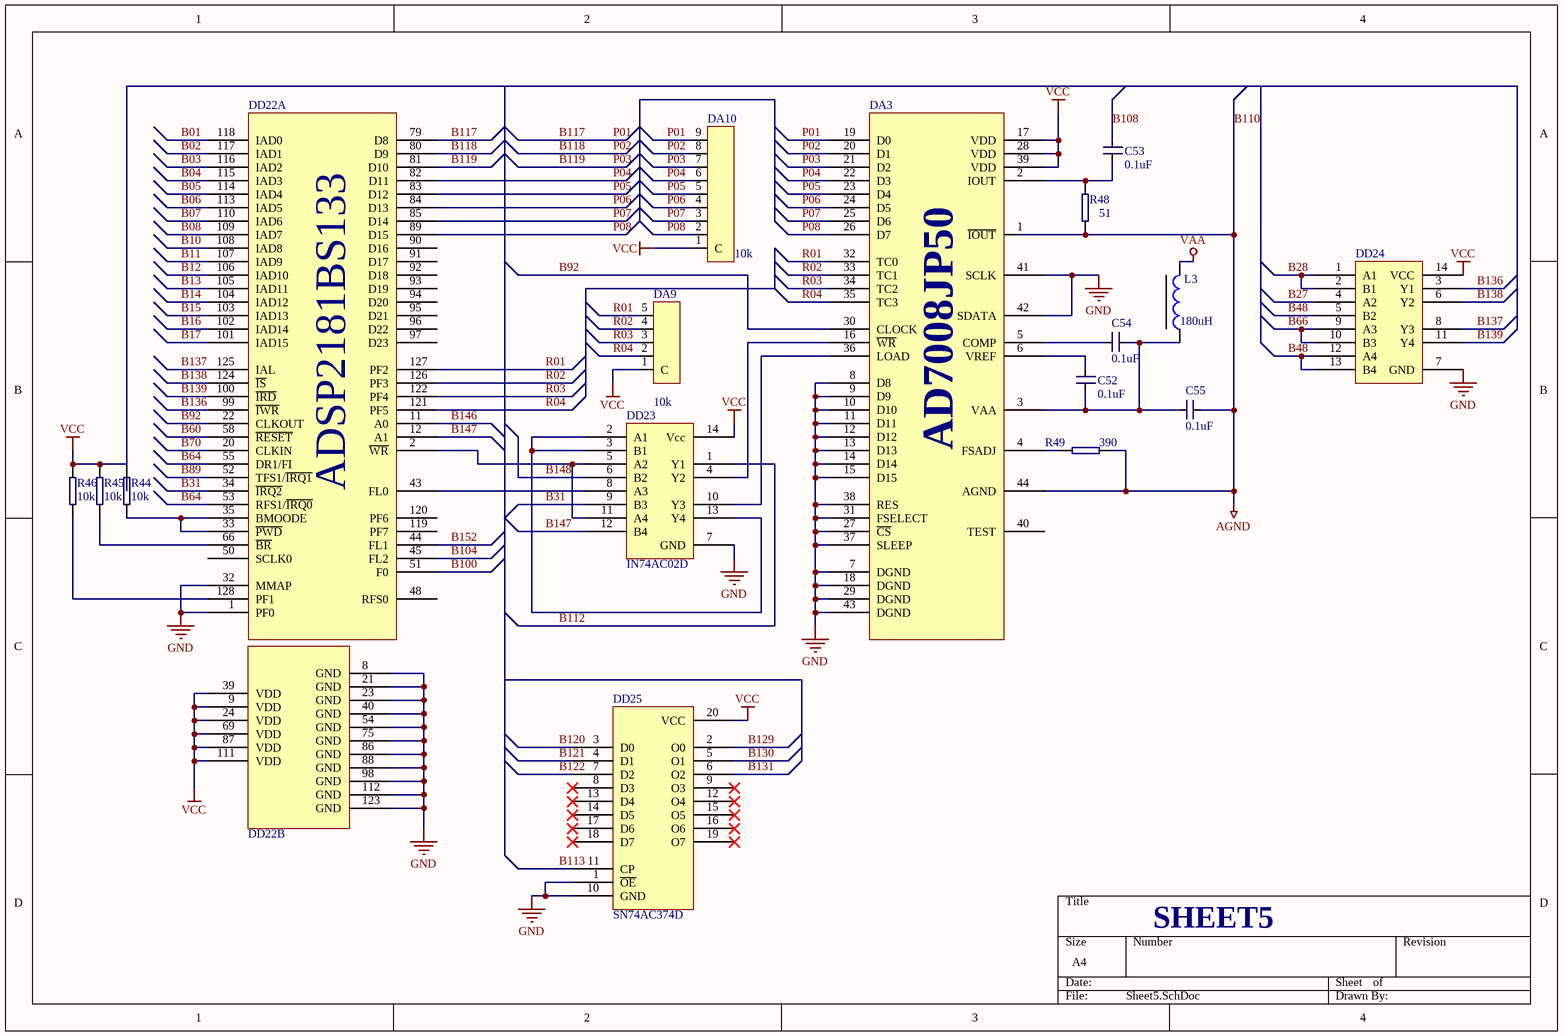
[diagram p5: Sheet5.SchDoc]

### Parts
C52  value 0.1uF  [0805]  (hidden comment: Cap)
C53  value 0.1uF  [0805]  (hidden comment: Cap)
C54  value 0.1uF  [0805]  (hidden comment: Cap)
C55  value 0.1uF  [0805]  (hidden comment: Cap)
DA3  AD7008JP50  [44 PLCC]  (value not drawn)
DA9  value 10k  [5 SIP]  (hidden comment: 5A103J)
DA10  value 10k  [9 SIP]  (hidden comment: 9A103J)
DD22  ADSP2181BS1332  [128 PQFP]  (value not drawn)  (parts A,B of 2)
DD23  IN74AC02D  [14 SOIC-3.9]
DD24  IN74AC08D  [14 TSSOP-4.4]  (value not drawn)
DD25  SN74AC374D  [20 SOIC-7.5]
L3  value 180uH  [E(1820)]  (hidden comment: L)
R44  value 10k  [0805]  (hidden comment: R)
R45  value 10k  [0805]  (hidden comment: R)
R46  value 10k  [0805]  (hidden comment: R)
R48  value 51  [0805]  (hidden comment: R)
R49  value 390  [0805]  (hidden comment: R)

### Nets
B110: C55.1 DA3.1(~{IOUT}) DA3.44(AGND) R48.1 R49.2  [also labelled AGND]
GND: DA3.7(DGND) DA3.8(D8) DA3.9(D9) DA3.10(D10) DA3.11(D11) DA3.12(D12) DA3.13(D13) DA3.14(D14) DA3.15(D15) DA3.18(DGND) DA3.27(~{CS}) DA3.29(DGND) DA3.31(FSELECT) DA3.37(SLEEP) DA3.38(RES) DA3.41(SCLK) DA3.42(SDATA) DA3.43(DGND) DD22.1(PF0) DD22.8(GND) DD22.21(GND) DD22.23(GND) DD22.32(MMAP) DD22.40(GND) DD22.54(GND) DD22.75(GND) DD22.86(GND) DD22.88(GND) DD22.98(GND) DD22.112(GND) DD22.123(GND) DD23.7(GND) DD24.7(GND) DD25.1(~{OE}) DD25.10(GND)
VAA: L3.2
VCC: DA3.17(VDD) DA3.28(VDD) DA3.39(VDD) DA9.1(C) DA10.1(C) DD22.9(VDD) DD22.24(VDD) DD22.39(VDD) DD22.69(VDD) DD22.87(VDD) DD22.111(VDD) DD23.14(Vcc) DD24.14(VCC) DD25.20(VCC) R44.2 R45.2 R46.2
B01: DD22.118(IAD0)
B02: DD22.117(IAD1)
B03: DD22.116(IAD2)
B04: DD22.115(IAD3)
B05: DD22.114(IAD4)
B06: DD22.113(IAD5)
B07: DD22.110(IAD6)
B08: DD22.109(IAD7)
B10: DD22.108(IAD8)
B11: DD22.107(IAD9)
B12: DD22.106(IAD10)
B13: DD22.105(IAD11)
B14: DD22.104(IAD12)
B15: DD22.103(IAD13)
B16: DD22.102(IAD14)
B17: DD22.101(IAD15)
B27: DD24.4(A2)
B28: DD24.1(A1) DD24.2(B1)
B31: DD22.34(~{IRQ2}) DD23.9(B3)
B48: DD24.5(B2) DD24.12(A4) DD24.13(B4)
B60: DD22.58(~{RESET})
B64: DD22.53(RFS1/~{IRQ0}) DD22.55(DR1/FI)
B66: DD24.9(A3) DD24.10(B3)
B70: DD22.20(CLKIN)
B89: DD22.52(TFS1/~{IRQ1})
B92: DA3.30(CLOCK) DD22.22(CLKOUT)
B100: DD22.51(F0)
B104: DD22.45(FL2)
B108: C53.2
B112: DD23.1(Y1)
B113: DD25.11(CP)
B117: DA3.19(D0) DA10.9 DD22.79(D8)  [also labelled P01]
B118: DA3.20(D1) DA10.8 DD22.80(D9)  [also labelled P02]
B119: DA3.21(D2) DA10.7 DD22.81(D10)  [also labelled P03]
B120: DD25.3(D0)
B121: DD25.4(D1)
B122: DD25.7(D2)
B129: DD25.2(O0)
B130: DD25.5(O1)
B131: DD25.6(O2)
B136: DD22.99(~{IWR}) DD24.3(Y1)
B137: DD22.125(IAL) DD24.8(Y3)
B138: DD22.124(~{IS}) DD24.6(Y2)
B139: DD22.100(~{IRD}) DD24.11(Y4)
B146: DD22.11(A0)
B147: DD22.12(A1) DD23.12(B4)
B148: DD23.6(B2)
B152: DD22.44(FL1)
P04: DA3.22(D3) DA10.6 DD22.82(D11)
P05: DA3.23(D4) DA10.5 DD22.83(D12)
P06: DA3.24(D5) DA10.4 DD22.84(D13)
P07: DA3.25(D6) DA10.3 DD22.85(D14)
P08: DA3.26(D7) DA10.2 DD22.89(D15)
R01: DA3.32(TC0) DA9.5 DD22.127(PF2)
R02: DA3.33(TC1) DA9.4 DD22.126(PF3)
R03: DA3.34(TC2) DA9.3 DD22.122(PF4)
R04: DA3.35(TC3) DA9.2 DD22.121(PF5)
NetC52_1: C52.1 C54.1 C55.2 DA3.3(VAA) L3.1
NetC52_2: C52.2 DA3.6(VREF)
NetC53_1: C53.1 DA3.2(IOUT) R48.2
NetC54_2: C54.2 DA3.5(COMP)
NetDA3_4: DA3.4(FSADJ) R49.1
NetDA3_16: DA3.16(~{WR}) DD23.4(Y2)
NetDA3_36: DA3.36(LOAD) DD23.10(Y3)
NetDD22_2: DD22.2(~{WR}) DD23.5(A2) DD23.11(A4)
NetDD22_33: DD22.33(~{PWD}) DD22.35(BMOODE) R44.1
NetDD22_43: DD22.43(FL0) DD23.8(A3)
NetDD22_66: DD22.66(~{BR}) R45.1
NetDD22_128: DD22.128(PF1) R46.1
NetDD23_2: DD23.2(A1) DD23.3(B1) DD23.13(Y4)

Not connected (* = marked no-connect by the designer): DA3 40(TEST); DD22 48(RFS0) 50(SCLK0) 90(D16) 91(D17) 92(D18) 93(D19) 94(D20) 95(D21) 96(D22) 97(D23) 119(PF7) 120(PF6); DD25 8(D3)* 9(O3)* 12(O4)* 13(D4)* 14(D5)* 15(O5)* 16(O6)* 17(D6)* 18(D7)* 19(O7)*

### Notes on the sheet
- SHEET5
- (in symbol ADSP2181BS1332, part A) ADSP2181BS133

## Sheet Sheet6.SchDoc
size A4
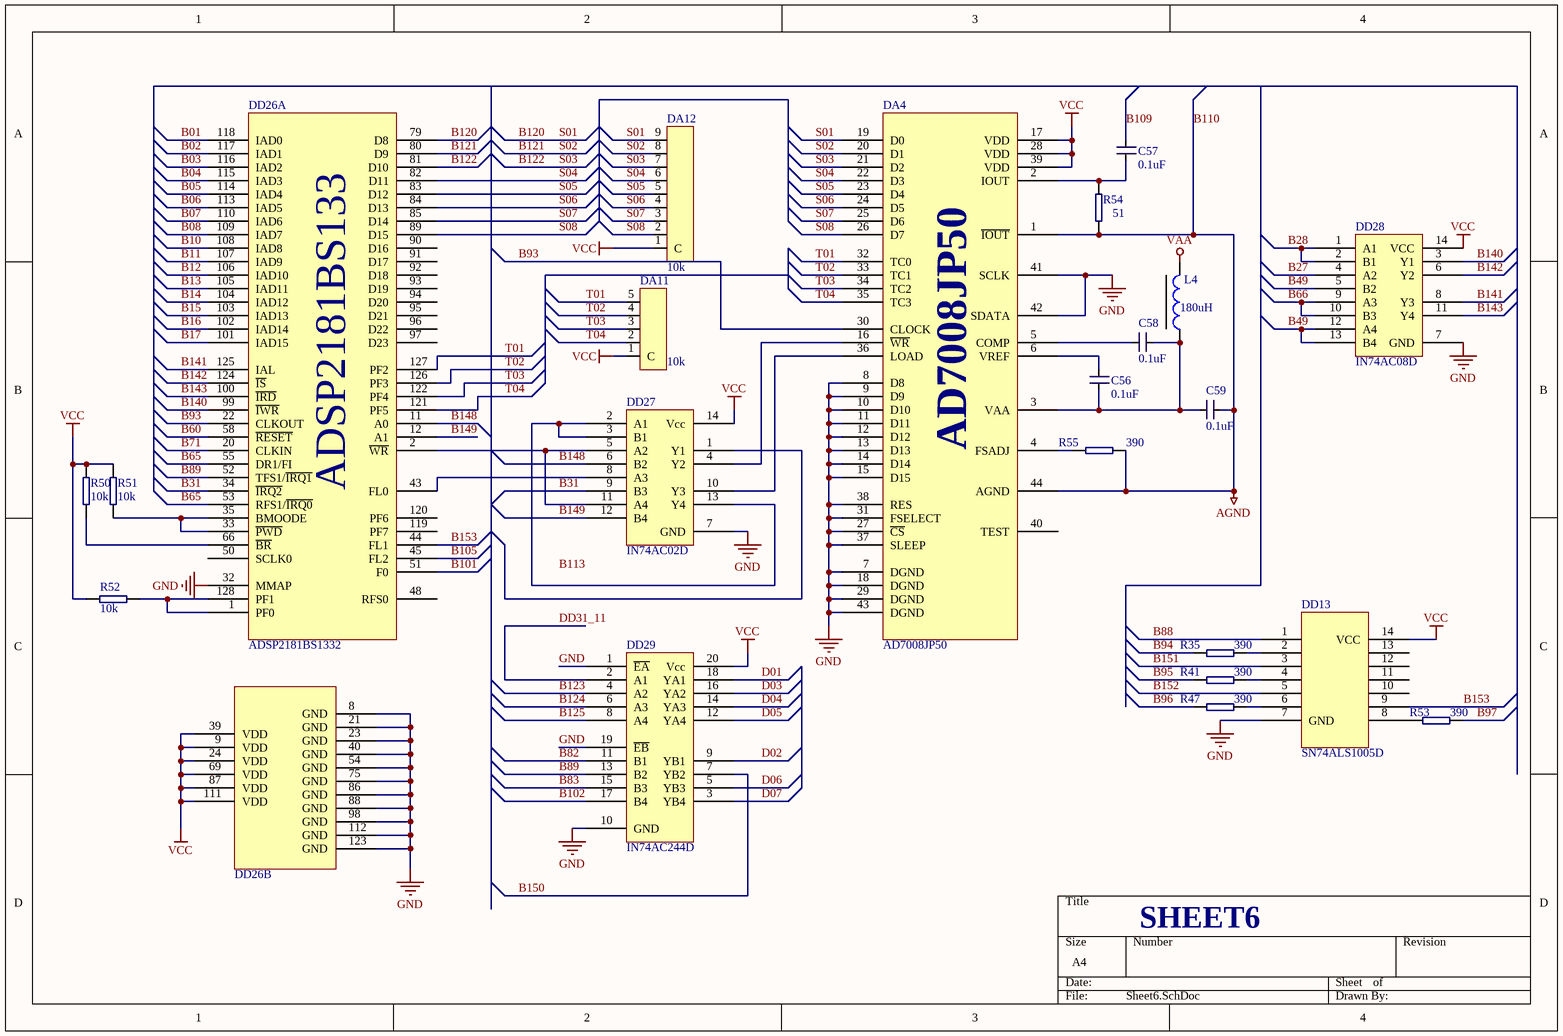
[diagram p6: Sheet6.SchDoc]

### Parts
C56  value 0.1uF  [0805]  (hidden comment: Cap)
C57  value 0.1uF  [0805]  (hidden comment: Cap)
C58  value 0.1uF  [0805]  (hidden comment: Cap)
C59  value 0.1uF  [0805]  (hidden comment: Cap)
DA4  AD7008JP50  [44 PLCC]
DA11  value 10k  [5 SIP]  (hidden comment: 5A103J)
DA12  value 10k  [9 SIP]  (hidden comment: 9A103J)
DD13  SN74ALS1005D  [14 SOIC-3.9]
DD26  ADSP2181BS1332  [128 PQFP]  (parts A,B of 2)
DD27  IN74AC02D  [14 SOIC-3.9]
DD28  IN74AC08D  [14 TSSOP-4.4]
DD29  IN74AC244D  [20 SOIC-7.5]
L4  value 180uH  [E(1820)]  (hidden comment: L)
R35  value 390  [0805]  (hidden comment: R)
R41  value 390  [0805]  (hidden comment: R)
R47  value 390  [0805]  (hidden comment: R)
R50  value 10k  [0805]  (hidden comment: R)
R51  value 10k  [0805]  (hidden comment: R)
R52  value 10k  [0805]  (hidden comment: R)
R53  value 390  [0805]  (hidden comment: R)
R54  value 51  [0805]  (hidden comment: R)
R55  value 390  [0805]  (hidden comment: R)

### Nets
B110: C59.1 DA4.1(~{IOUT}) DA4.44(AGND) R54.1 R55.2  [also labelled AGND]
GND: DA4.7(DGND) DA4.8(D8) DA4.9(D9) DA4.10(D10) DA4.11(D11) DA4.12(D12) DA4.13(D13) DA4.14(D14) DA4.15(D15) DA4.18(DGND) DA4.27(~{CS}) DA4.29(DGND) DA4.31(FSELECT) DA4.37(SLEEP) DA4.38(RES) DA4.41(SCLK) DA4.42(SDATA) DA4.43(DGND) DD13.7(GND) DD26.8(GND) DD26.21(GND) DD26.23(GND) DD26.32(MMAP) DD26.40(GND) DD26.54(GND) DD26.75(GND) DD26.86(GND) DD26.88(GND) DD26.98(GND) DD26.112(GND) DD26.123(GND) DD27.7(GND) DD28.7(GND) DD29.1(~{EA}) DD29.10(GND) DD29.19(~{EB})
VAA: L4.2
VCC: DA4.17(VDD) DA4.28(VDD) DA4.39(VDD) DA11.1(C) DA12.1(C) DD13.14(VCC) DD26.9(VDD) DD26.24(VDD) DD26.39(VDD) DD26.69(VDD) DD26.87(VDD) DD26.111(VDD) DD27.14(Vcc) DD28.14(VCC) DD29.20(Vcc) R50.2 R51.2 R52.2
B01: DD26.118(IAD0)
B02: DD26.117(IAD1)
B03: DD26.116(IAD2)
B04: DD26.115(IAD3)
B05: DD26.114(IAD4)
B06: DD26.113(IAD5)
B07: DD26.110(IAD6)
B08: DD26.109(IAD7)
B10: DD26.108(IAD8)
B11: DD26.107(IAD9)
B12: DD26.106(IAD10)
B13: DD26.105(IAD11)
B14: DD26.104(IAD12)
B15: DD26.103(IAD13)
B16: DD26.102(IAD14)
B17: DD26.101(IAD15)
B27: DD28.4(A2)
B28: DD28.1(A1) DD28.2(B1)
B31: DD26.34(~{IRQ2}) DD27.9(B3)
B49: DD28.5(B2) DD28.12(A4) DD28.13(B4)
B60: DD26.58(~{RESET})
B65: DD26.53(RFS1/~{IRQ0}) DD26.55(DR1/FI)
B66: DD28.9(A3) DD28.10(B3)
B71: DD26.20(CLKIN)
B82: DD29.11(B1)
B83: DD29.15(B3)
B88: DD13.1
B89: DD26.52(TFS1/~{IRQ1}) DD29.13(B2)
B93: DA4.30(CLOCK) DD26.22(CLKOUT)
B94: R35.2
B95: R41.2
B96: R47.2
B97: R53.1
B101: DD26.51(F0)
B102: DD29.17(B4)
B105: DD26.45(FL2)
B109: C57.2
B120: DA4.19(D0) DA12.9 DD26.79(D8)  [also labelled S01]
B121: DA4.20(D1) DA12.8 DD26.80(D9)  [also labelled S02]
B122: DA4.21(D2) DA12.7 DD26.81(D10)  [also labelled S03]
B123: DD29.4(A2)
B124: DD29.6(A3)
B125: DD29.8(A4)
B140: DD26.99(~{IWR}) DD28.3(Y1)
B141: DD26.125(IAL) DD28.8(Y3)
B142: DD26.124(~{IS}) DD28.6(Y2)
B143: DD26.100(~{IRD}) DD28.11(Y4)
B148: DD26.11(A0) DD27.6(B2)
B149: DD26.12(A1) DD27.12(B4)
B150: DD29.7(YB2)
B151: DD13.3
B152: DD13.5
B153: DD13.9 DD26.44(FL1)
D01: DD29.18(YA1)
D02: DD29.9(YB1)
D03: DD29.16(YA2)
D04: DD29.14(YA3)
D05: DD29.12(YA4)
D06: DD29.5(YB3)
D07: DD29.3(YB4)
DD31_11: DD29.2(A1)
S04: DA4.22(D3) DA12.6 DD26.82(D11)
S05: DA4.23(D4) DA12.5 DD26.83(D12)
S06: DA4.24(D5) DA12.4 DD26.84(D13)
S07: DA4.25(D6) DA12.3 DD26.85(D14)
S08: DA4.26(D7) DA12.2 DD26.89(D15)
T01: DA4.32(TC0) DA11.5 DD26.127(PF2)
T02: DA4.33(TC1) DA11.4 DD26.126(PF3)
T03: DA4.34(TC2) DA11.3 DD26.122(PF4)
T04: DA4.35(TC3) DA11.2 DD26.121(PF5)
NetC56_1: C56.1 C58.1 C59.2 DA4.3(VAA) L4.1
NetC56_2: C56.2 DA4.6(VREF)
NetC57_1: C57.1 DA4.2(IOUT) R54.2
NetC58_2: C58.2 DA4.5(COMP)
NetDA4_4: DA4.4(FSADJ) R55.1
NetDA4_16: DA4.16(~{WR}) DD27.4(Y2)
NetDA4_36: DA4.36(LOAD) DD27.10(Y3)
NetDD13_2: DD13.2 R35.1
NetDD13_4: DD13.4 R41.1
NetDD13_6: DD13.6 R47.1
NetDD13_8: DD13.8 R53.2
NetDD26_1: DD26.1(PF0) DD26.128(PF1) R52.1
NetDD26_2: DD26.2(~{WR}) DD27.5(A2) DD27.11(A4)
NetDD26_33: DD26.33(~{PWD}) DD26.35(BMOODE) R51.1
NetDD26_43: DD26.43(FL0) DD27.8(A3)
NetDD26_66: DD26.66(~{BR}) R50.1
NetDD27_2: DD27.2(A1) DD27.3(B1) DD27.13(Y4)

Not connected (* = marked no-connect by the designer): DA4 40(TEST); DD13 10 11 12 13; DD26 48(RFS0) 50(SCLK0) 90(D16) 91(D17) 92(D18) 93(D19) 94(D20) 95(D21) 96(D22) 97(D23) 119(PF7) 120(PF6); DD27 1(Y1)

### Notes on the sheet
- SHEET6
- Labels drawn without touching a wire or pin: B113
- (in symbol ADSP2181BS1332, part A) ADSP2181BS133

## Sheet Sheet7.SchDoc
size A4
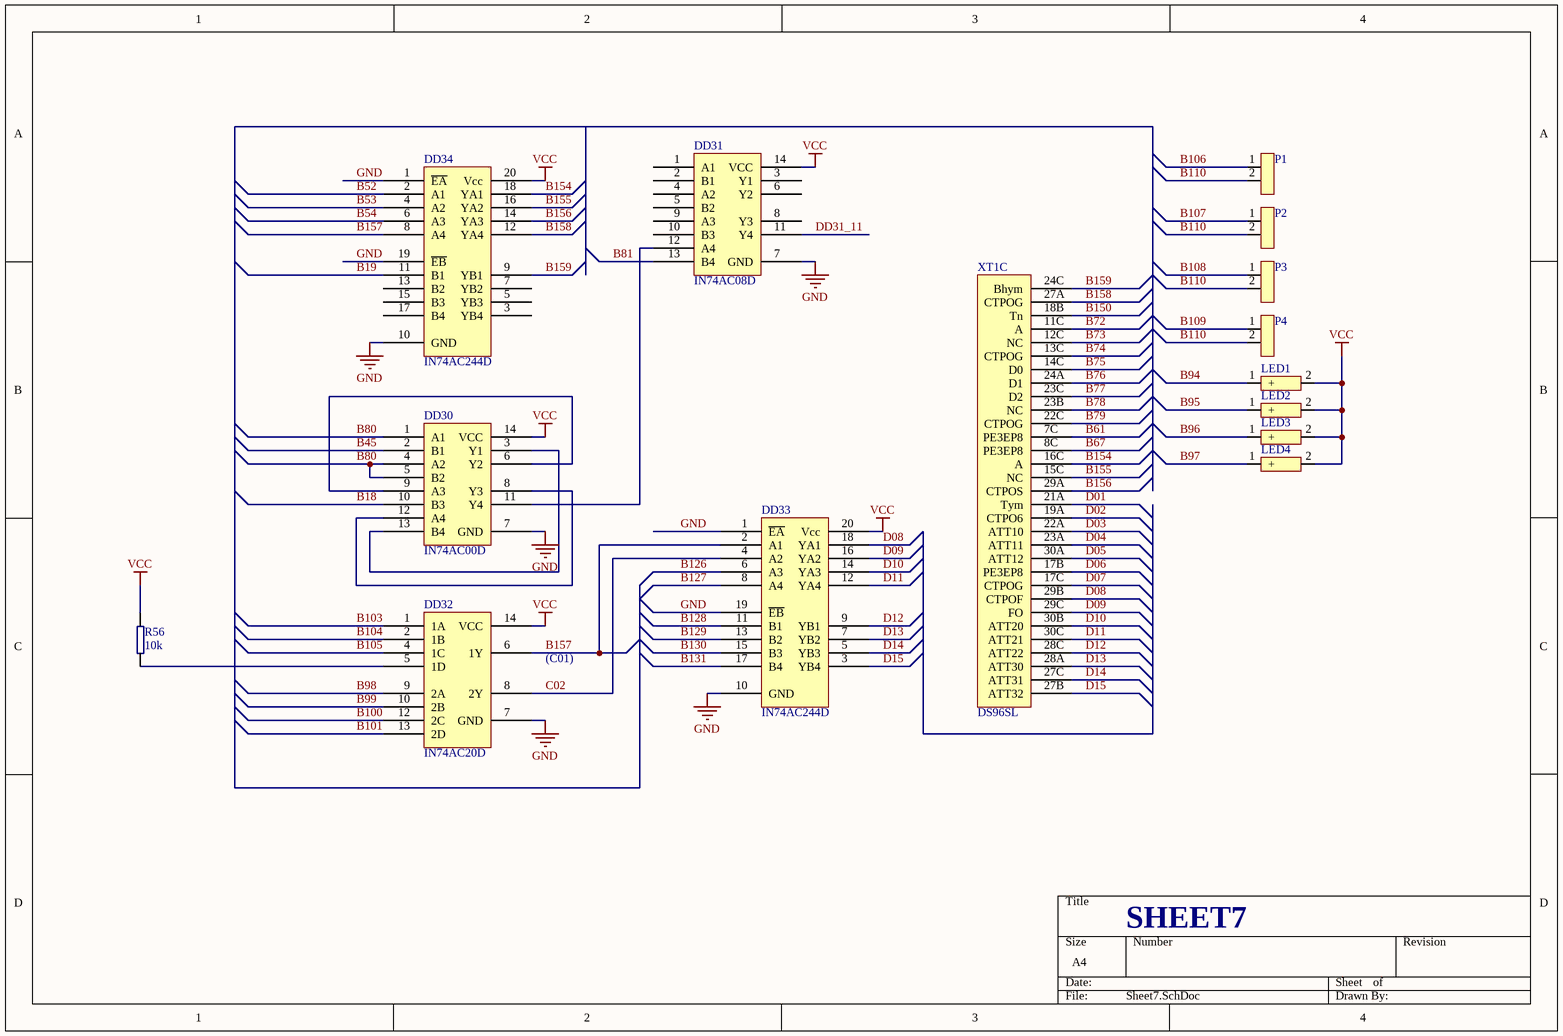
[diagram p7: Sheet7.SchDoc]

### Parts
DD30  IN74AC00D  [14 SOIC-3.9]
DD31  IN74AC08D  [14 TSSOP-4.4]
DD32  IN74AC20D  [14 SOIC-3.9]
DD33  IN74AC244D  [20 SOIC-7.5]
DD34  IN74AC244D  [20 SOIC-7.5]
LED1  LED  [LED]  (value not drawn)
LED2  LED  [LED]  (value not drawn)
LED3  LED  [LED]  (value not drawn)
LED4  LED  [LED]  (value not drawn)
P1  PIN2  [2 SIP]  (value not drawn)
P2  PIN2  [2 SIP]  (value not drawn)
P3  PIN2  [2 SIP]  (value not drawn)
P4  PIN2  [2 SIP]  (value not drawn)
R56  value 10k  [0805]  (hidden comment: R)
XT1  DS96SL  [DS96]  (part C of 3)

### Nets
B110: P1.2 P2.2 P3.2 P4.2
GND: DD30.7(GND) DD31.7(GND) DD32.7(GND) DD33.1(~{EA}) DD33.10(GND) DD33.19(~{EB}) DD34.1(~{EA}) DD34.10(GND) DD34.19(~{EB})
VCC: DD30.14(VCC) DD31.14(VCC) DD32.14(VCC) DD33.20(Vcc) DD34.20(Vcc) LED1.2 LED2.2 LED3.2 LED4.2 R56.1
B18: DD30.10(B3)
B19: DD34.11(B1)
B45: DD30.2(B1)
B52: DD34.2(A1)
B53: DD34.4(A2)
B54: DD34.6(A3)
B61: XT1.7C(PE3EP8)
B67: XT1.8C(PE3EP8)
B72: XT1.11C(A)
B73: XT1.12C(NC)
B74: XT1.13C(CTPOG)
B75: XT1.14C(D0)
B76: XT1.24A(D1)
B77: XT1.23C(D2)
B78: XT1.23B(NC)
B79: XT1.22C(CTPOG)
B80: DD30.1(A1) DD30.4(A2) DD30.5(B2)
B81: DD31.13(B4)
B94: LED1.1(+)
B95: LED2.1(+)
B96: LED3.1(+)
B97: LED4.1(+)
B98: DD32.9(2A)
B99: DD32.10(2B)
B100: DD32.12(2C)
B101: DD32.13(2D)
B103: DD32.1(1A)
B104: DD32.2(1B)
B105: DD32.4(1C)
B106: P1.1
B107: P2.1
B108: P3.1
B109: P4.1
B126: DD33.6(A3)
B127: DD33.8(A4)
B128: DD33.11(B1)
B129: DD33.13(B2)
B130: DD33.15(B3)
B131: DD33.17(B4)
B150: XT1.18B(Tn)
B154: DD34.18(YA1) XT1.16C(A)
B155: DD34.16(YA2) XT1.15C(NC)
B156: DD34.14(YA3) XT1.29A(CTPOS)
B157: DD32.6(1Y) DD33.2(A1) DD34.8(A4)
B158: DD34.12(YA4) XT1.27A(CTPOG)
B159: DD34.9(YB1) XT1.24C(Bhym)
C02: DD32.8(2Y) DD33.4(A2)
D01: XT1.21A(Tym)
D02: XT1.19A(CTPO6)
D03: XT1.22A(ATT10)
D04: XT1.23A(ATT11)
D05: XT1.30A(ATT12)
D06: XT1.17B(PE3EP8)
D07: XT1.17C(CTPOG)
D08: DD33.18(YA1) XT1.29B(CTPOF)
D09: DD33.16(YA2) XT1.29C(FO)
D10: DD33.14(YA3) XT1.30B(ATT20)
D11: DD33.12(YA4) XT1.30C(ATT21)
D12: DD33.9(YB1) XT1.28C(ATT22)
D13: DD33.7(YB2) XT1.28A(ATT30)
D14: DD33.5(YB3) XT1.27C(ATT31)
D15: DD33.3(YB4) XT1.27B(ATT32)
DD31_11: DD31.11(Y4)
NetDD30_3: DD30.3(Y1) DD30.13(B4)
NetDD30_6: DD30.6(Y2) DD30.9(A3)
NetDD30_8: DD30.8(Y3) DD30.12(A4)
NetDD30_11: DD30.11(Y4) DD31.12(A4)
NetDD32_5: DD32.5(1D) R56.2

Not connected (* = marked no-connect by the designer): DD31 1(A1) 2(B1) 3(Y1) 4(A2) 5(B2) 6(Y2) 8(Y3) 9(A3) 10(B3); DD34 3(YB4) 5(YB3) 7(YB2) 13(B2) 15(B3) 17(B4)

### Notes on the sheet
- (C01)
- SHEET7

## Nets that join several sheets
B110: Sheet1 (C1.2 XT1.26A XT1.26B XT1.26C), Sheet3 (5 pins), Sheet4 (5 pins), Sheet5 (5 pins), Sheet6 (5 pins), Sheet7 (P1.2 P2.2 P3.2 P4.2)
GND: Sheet1 (55 pins), Sheet2 (28 pins), Sheet3 (37 pins), Sheet4 (35 pins), Sheet5 (35 pins), Sheet6 (36 pins), Sheet7 (9 pins)
VAA: Sheet1 (C1.1 XT1.25A XT1.25B XT1.25C), Sheet3 (L1.1), Sheet4 (L2.2), Sheet5 (L3.2), Sheet6 (L4.2)
VCC: Sheet1 (52 pins), Sheet2 (13 pins), Sheet3 (16 pins), Sheet4 (17 pins), Sheet5 (17 pins), Sheet6 (18 pins), Sheet7 (10 pins)
A19: Sheet1 (C60.2 R31.2 XT1.6B), Sheet2 (DD9.6)
A30: Sheet1 (XT1.7B), Sheet2 (DD10.13)
A34: Sheet1 (R19.2 R29.2), Sheet2 (DD9.2)
A36: Sheet1 (R1.2), Sheet2 (DD1.2)
A37: Sheet1 (R2.2), Sheet2 (DD1.3)
A38: Sheet1 (R3.2), Sheet2 (DD1.4)
A39: Sheet1 (R4.2), Sheet2 (DD1.5)
A40: Sheet1 (R5.2), Sheet2 (DD1.6)
A41: Sheet1 (R6.2), Sheet2 (DD1.7)
A42: Sheet1 (R7.2), Sheet2 (DD1.8)
A43: Sheet1 (R8.2), Sheet2 (DD1.9)
A44: Sheet1 (R9.2), Sheet2 (DD2.2)
A45: Sheet1 (R10.2), Sheet2 (DD2.3)
A46: Sheet1 (R11.2), Sheet2 (DD2.4)
A47: Sheet1 (R12.2), Sheet2 (DD2.5)
A48: Sheet1 (R13.2), Sheet2 (DD2.6)
A49: Sheet1 (R14.2), Sheet2 (DD2.7)
A50: Sheet1 (R15.2), Sheet2 (DD2.8)
A51: Sheet1 (R16.2), Sheet2 (DD2.9)
A52: Sheet1 (R17.2), Sheet2 (DD9.4)
A53: Sheet1 (R18.2), Sheet2 (DD4.6)
A54: Sheet1 (R20.2), Sheet2 (DD4.2)
A55: Sheet1 (R21.2), Sheet2 (DD4.4)
A56: Sheet1 (R22.2), Sheet2 (DD3.2)
A57: Sheet1 (R23.2), Sheet2 (DD4.8)
A58: Sheet1 (R24.2), Sheet2 (DD4.11)
A59: Sheet1 (R25.2), Sheet2 (DD4.13)
A60: Sheet1 (R26.2), Sheet2 (DD9.8)
A61: Sheet1 (R27.2 R30.2), Sheet2 (DD4.17)
A62: Sheet1 (R28.2), Sheet2 (DD4.15)
B01: Sheet2 (DD1.18), Sheet3 (DD14.118), Sheet4 (DD18.118), Sheet5 (DD22.118), Sheet6 (DD26.118)
B02: Sheet2 (DD1.17), Sheet3 (DD14.117), Sheet4 (DD18.117), Sheet5 (DD22.117), Sheet6 (DD26.117)
B03: Sheet2 (DD1.16), Sheet3 (DD14.116), Sheet4 (DD18.116), Sheet5 (DD22.116), Sheet6 (DD26.116)
B04: Sheet2 (DD1.15), Sheet3 (DD14.115), Sheet4 (DD18.115), Sheet5 (DD22.115), Sheet6 (DD26.115)
B05: Sheet2 (DD1.14), Sheet3 (DD14.114), Sheet4 (DD18.114), Sheet5 (DD22.114), Sheet6 (DD26.114)
B06: Sheet2 (DD1.13), Sheet3 (DD14.113), Sheet4 (DD18.113), Sheet5 (DD22.113), Sheet6 (DD26.113)
B07: Sheet2 (DD1.12), Sheet3 (DD14.110), Sheet4 (DD18.110), Sheet5 (DD22.110), Sheet6 (DD26.110)
B08: Sheet2 (DD1.11), Sheet3 (DD14.109), Sheet4 (DD18.109), Sheet5 (DD22.109), Sheet6 (DD26.109)
B10: Sheet2 (DD2.18), Sheet3 (DD14.108), Sheet4 (DD18.108), Sheet5 (DD22.108), Sheet6 (DD26.108)
B11: Sheet2 (DD2.17), Sheet3 (DD14.107), Sheet4 (DD18.107), Sheet5 (DD22.107), Sheet6 (DD26.107)
B12: Sheet2 (DD2.16), Sheet3 (DD14.106), Sheet4 (DD18.106), Sheet5 (DD22.106), Sheet6 (DD26.106)
B13: Sheet2 (DD2.15), Sheet3 (DD14.105), Sheet4 (DD18.105), Sheet5 (DD22.105), Sheet6 (DD26.105)
B14: Sheet2 (DD2.14), Sheet3 (DD14.104), Sheet4 (DD18.104), Sheet5 (DD22.104), Sheet6 (DD26.104)
B15: Sheet2 (DD2.13), Sheet3 (DD14.103), Sheet4 (DD18.103), Sheet5 (DD22.103), Sheet6 (DD26.103)
B16: Sheet2 (DD2.12), Sheet3 (DD14.102), Sheet4 (DD18.102), Sheet5 (DD22.102), Sheet6 (DD26.102)
B17: Sheet2 (DD2.11), Sheet3 (DD14.101), Sheet4 (DD18.101), Sheet5 (DD22.101), Sheet6 (DD26.101)
B18: Sheet2 (DD3.16), Sheet7 (DD30.10)
B19: Sheet2 (DD8.15), Sheet7 (DD34.11)
B27: Sheet2 (DD4.12), Sheet3 (DD16.4), Sheet4 (DD20.4), Sheet5 (DD24.4), Sheet6 (DD28.4)
B28: Sheet2 (DD4.9), Sheet3 (DD16.1 DD16.2), Sheet4 (DD20.1 DD20.2), Sheet5 (DD24.1 DD24.2), Sheet6 (DD28.1 DD28.2)
B31: Sheet2 (DD4.3), Sheet3 (C61.2 DD14.34 DD14.50 DD15.9), Sheet4 (DD18.34 DD19.9), Sheet5 (DD22.34 DD23.9), Sheet6 (DD26.34 DD27.9)
B32: Sheet2 (DD6.13), Sheet3 (DD14.11)
B33: Sheet2 (DD6.14), Sheet3 (DD14.12)
B34: Sheet2 (DD6.15), Sheet3 (DD14.2)
B37: Sheet2 (DD7.3 DD8.3 DD12.3), Sheet3 (DA1.19 DA6.9 DD14.79)
B38: Sheet2 (DD7.4 DD8.4 DD12.4), Sheet3 (DA1.20 DA6.8 DD14.80)
B39: Sheet2 (DD7.7 DD8.7 DD12.7), Sheet3 (DA1.21 DA6.7 DD14.81)
B40: Sheet2 (DD8.8 DD12.8), Sheet3 (DA1.22 DA6.6 DD14.82)
B41: Sheet2 (DD8.13), Sheet3 (DA1.23 DA6.5 DD14.83)
B42: Sheet2 (DD8.14), Sheet3 (DA1.24 DA6.4 DD14.84)
B45: Sheet2 (DD5.6), Sheet7 (DD30.2)
B46: Sheet2 (DD6.4), Sheet3 (DD16.5 DD16.12 DD16.13)
B47: Sheet2 (DD6.5), Sheet4 (DD20.5 DD20.12 DD20.13)
B48: Sheet2 (DD6.6), Sheet5 (DD24.5 DD24.12 DD24.13)
B49: Sheet2 (DD6.7), Sheet6 (DD28.5 DD28.12 DD28.13)
B50: Sheet2 (DD6.11), Sheet3 (DD15.5 DD15.6)
B52: Sheet2 (DD7.2 DD11.2), Sheet7 (DD34.2)
B53: Sheet2 (DD7.5 DD11.4), Sheet7 (DD34.4)
B54: Sheet2 (DD7.6 DD11.6), Sheet7 (DD34.6)
B60: Sheet2 (DD9.14), Sheet3 (DD14.58), Sheet4 (DD18.58), Sheet5 (DD22.58), Sheet6 (DD26.58)
B61: Sheet2 (DD9.12), Sheet7 (XT1.7C)
B62: Sheet2 (DD9.9), Sheet3 (DD14.53 DD14.55)
B63: Sheet2 (DD9.7), Sheet4 (DD18.53 DD18.55)
B64: Sheet2 (DD9.5), Sheet5 (DD22.53 DD22.55)
B65: Sheet2 (DD9.3), Sheet6 (DD26.53 DD26.55)
B66: Sheet2 (DD10.10), Sheet3 (DD16.9 DD16.10), Sheet4 (DD20.9 DD20.10), Sheet5 (DD24.9 DD24.10), Sheet6 (DD28.9 DD28.10)
B67: Sheet2 (DD10.12), Sheet7 (XT1.8C)
B68: Sheet2 (DD10.2), Sheet3 (DD14.20)
B69: Sheet2 (DD10.4), Sheet4 (DD18.20)
B70: Sheet2 (DD10.6), Sheet5 (DD22.20)
B71: Sheet2 (DD10.8), Sheet6 (DD26.20)
B72: Sheet2 (DD11.18), Sheet7 (XT1.11C)
B73: Sheet2 (DD11.16), Sheet7 (XT1.12C)
B74: Sheet2 (DD11.14), Sheet7 (XT1.13C)
B75: Sheet2 (DD11.12), Sheet7 (XT1.14C)
B76: Sheet2 (DD11.9), Sheet7 (XT1.24A)
B77: Sheet2 (DD11.7), Sheet7 (XT1.23C)
B78: Sheet2 (DD11.5), Sheet7 (XT1.23B)
B79: Sheet2 (DD11.3), Sheet7 (XT1.22C)
B80: Sheet2 (DD12.2), Sheet7 (DD30.1 DD30.4 DD30.5)
B81: Sheet2 (DD12.5), Sheet7 (DD31.13)
B82: Sheet2 (DD12.6), Sheet6 (DD29.11)
B83: Sheet2 (DD12.9), Sheet6 (DD29.15)
B88: Sheet3 (DD14.44), Sheet6 (DD13.1)
B89: Sheet3 (DD14.48 DD14.52), Sheet4 (DD18.52), Sheet5 (DD22.52), Sheet6 (DD26.52 DD29.13)
B94: Sheet6 (R35.2), Sheet7 (LED1.1)
B95: Sheet6 (R41.2), Sheet7 (LED2.1)
B96: Sheet6 (R47.2), Sheet7 (LED3.1)
B97: Sheet6 (R53.1), Sheet7 (LED4.1)
B98: Sheet3 (DD14.51), Sheet7 (DD32.9)
B99: Sheet4 (DD18.51), Sheet7 (DD32.10)
B100: Sheet5 (DD22.51), Sheet7 (DD32.12)
B101: Sheet6 (DD26.51), Sheet7 (DD32.13)
B102: Sheet3 (DD14.45), Sheet6 (DD29.17)
B103: Sheet4 (DD18.45), Sheet7 (DD32.1)
B104: Sheet5 (DD22.45), Sheet7 (DD32.2)
B105: Sheet6 (DD26.45), Sheet7 (DD32.4)
B106: Sheet3 (C45.2), Sheet7 (P1.1)
B107: Sheet4 (C49.2), Sheet7 (P2.1)
B108: Sheet5 (C53.2), Sheet7 (P3.1)
B109: Sheet6 (C57.2), Sheet7 (P4.1)
B111: Sheet3 (DD17.11), Sheet4 (DD19.1)
B112: Sheet4 (DD21.11), Sheet5 (DD23.1)
B114: Sheet3 (DD17.3), Sheet4 (DA2.19 DA8.9 DD18.79)
B115: Sheet3 (DD17.4), Sheet4 (DA2.20 DA8.8 DD18.80)
B116: Sheet3 (DD17.7), Sheet4 (DA2.21 DA8.7 DD18.81)
B117: Sheet4 (DD21.3), Sheet5 (DA3.19 DA10.9 DD22.79)
B118: Sheet4 (DD21.4), Sheet5 (DA3.20 DA10.8 DD22.80)
B119: Sheet4 (DD21.7), Sheet5 (DA3.21 DA10.7 DD22.81)
B120: Sheet5 (DD25.3), Sheet6 (DA4.19 DA12.9 DD26.79)
B121: Sheet5 (DD25.4), Sheet6 (DA4.20 DA12.8 DD26.80)
B122: Sheet5 (DD25.7), Sheet6 (DA4.21 DA12.7 DD26.81)
B123: Sheet3 (DD17.2), Sheet6 (DD29.4)
B124: Sheet3 (DD17.5), Sheet6 (DD29.6)
B125: Sheet3 (DD17.6), Sheet6 (DD29.8)
B126: Sheet4 (DD21.2), Sheet7 (DD33.6)
B127: Sheet4 (DD21.5), Sheet7 (DD33.8)
B128: Sheet4 (DD21.6), Sheet7 (DD33.11)
B129: Sheet5 (DD25.2), Sheet7 (DD33.13)
B130: Sheet5 (DD25.5), Sheet7 (DD33.15)
B131: Sheet5 (DD25.6), Sheet7 (DD33.17)
B148: Sheet5 (DD23.6), Sheet6 (DD26.11 DD27.6)
B150: Sheet6 (DD29.7), Sheet7 (XT1.18B)
B151: Sheet4 (DD18.44), Sheet6 (DD13.3)
B152: Sheet5 (DD22.44), Sheet6 (DD13.5)
D01: Sheet6 (DD29.18), Sheet7 (XT1.21A)
D02: Sheet6 (DD29.9), Sheet7 (XT1.19A)
D03: Sheet6 (DD29.16), Sheet7 (XT1.22A)
D04: Sheet6 (DD29.14), Sheet7 (XT1.23A)
D05: Sheet6 (DD29.12), Sheet7 (XT1.30A)
D06: Sheet6 (DD29.5), Sheet7 (XT1.17B)
D07: Sheet6 (DD29.3), Sheet7 (XT1.17C)
DD31_11: Sheet6 (DD29.2), Sheet7 (DD31.11)